# EAGLE design VCF-LM324-Stereo+LFO (EAGLE 7.6.0)
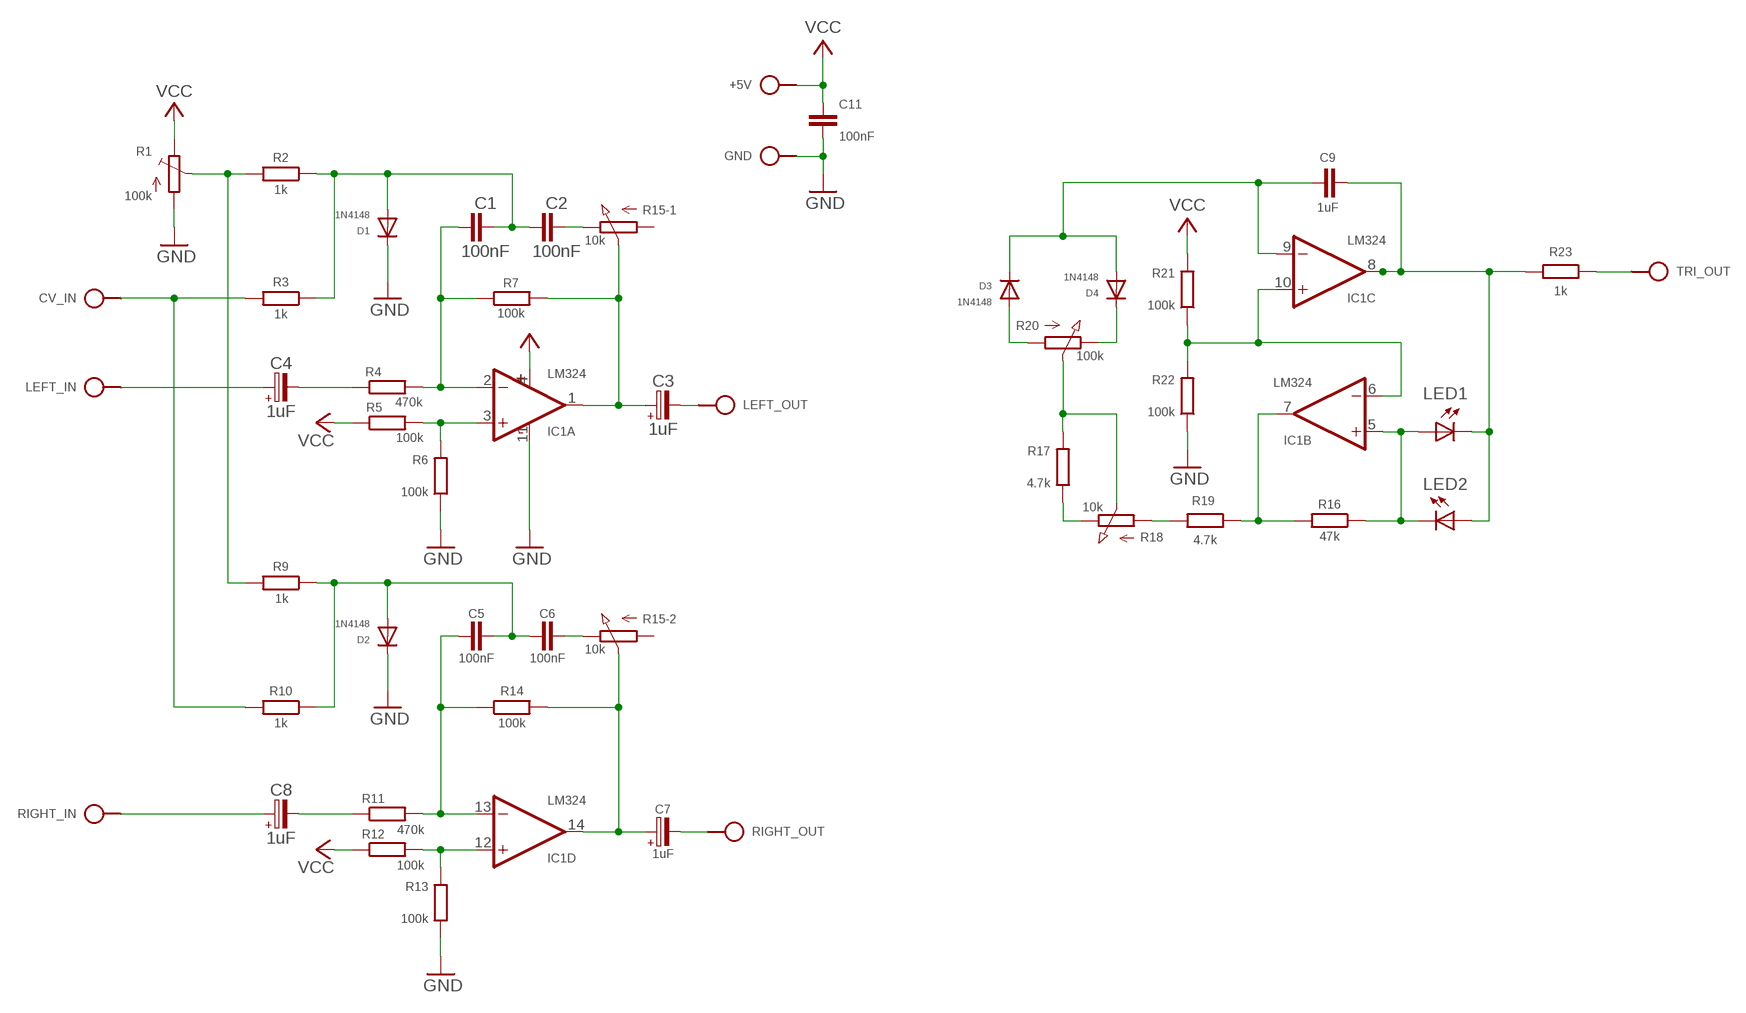
[diagram p0: schematic, sheet 1]

## Parts
+5V  VCC  SPAD  [SPAD]
C1  100nF  C050-024X044  [C050-024X044]
C2  100nF  C050-024X044  [C050-024X044]
C3  1uF  CPOLE2,5-3  [E2,5-3]
C4  1uF  CPOLE2,5-3  [E2,5-3]
C5  100nF  C050-024X044  [C050-024X044]
C6  100nF  C050-024X044  [C050-024X044]
C7  1uF  CPOLE2,5-3  [E2,5-3]
C8  1uF  CPOLE2,5-3  [E2,5-3]
C9  1uF  C050-024X044/V  [C050-024X044/V]
C11  100nF  C050-020X036  [C050-020X036]
CV_IN  CV_IN  SPAD  [SPAD]
D1  1N4148  1N414834-10V  [DO34-10V]
D2  1N4148  1N414834-7V  [DO34-7V]
D3  1N4148  1N414834-7V  [DO34-7V]
D4  1N4148  1N414834-7V  [DO34-7V]
GND  GND  SPAD  [SPAD]
IC1  LM324  LM324N  [DIL14]
LED1  LED3MM  [LED3MM]
LED2  LED3MM  [LED3MM]
LEFT_IN  AUDIO_IN  SPAD  [SPAD]
LEFT_OUT  AUDIO_OUT  SPAD  [SPAD]
R1  100k  TRIM  [B64Y]
R2  1k  R0202/7  [0202/7]
R3  1k  R0202/7  [0202/7]
R4  470k  R0202/7  [0202/7]
R5  100k  R0202/7  [0202/7]
R6  100k  R0202/7  [0202/7]
R7  100k  R0202/7  [0202/7]
R9  1k  R0202/7  [0202/7]
R10  1k  R0202/5  [0202/5]
R11  470k  R0202/7  [0202/7]
R12  100k  R0202/5  [0202/5]
R13  100k  R0202V  [0202V]
R14  100k  R0202/5  [0202/5]
R15  10k  POT-STEREO  [POT-STEREO]
R16  47k  R0202/7-V  [0202/7-V]
R17  4.7k  R0202/7  [0202/7]
R18  10k  POT  [POT]
R19  4.7k  R0202/7-V  [0202/7-V]
R20  100k  POT  [POT]
R21  100k  R0202/7-V  [0202/7-V]
R22  100k  R0202/7-V  [0202/7-V]
R23  1k  R0202/7-V  [0202/7-V]
RIGHT_IN  AUDIO_IN  SPAD  [SPAD]
RIGHT_OUT  AUDIO_OUT  SPAD  [SPAD]
TRI_OUT  TRIANGLE  SPAD  [SPAD]

## Nets
GND: C11.2 D1.C D2.C GND.1 IC1.11(P:V-) R1.A R6.1 R13.1 R22.1
N$1: C4.+ LEFT_IN.1
N$2: C1.1 IC1.2(A:-IN) R4.2 R7.1
N$3: C2.2 R15.1-3(-1:E)
N$4: C3.+ IC1.1(A:OUT) R7.2 R15.1-2(-1:S)
N$5: R1.S R2.2 R9.2
N$6: C3.- LEFT_OUT.1
N$7: IC1.3(A:+IN) R5.2 R6.2
N$8: CV_IN.1 R3.2 R10.2
N$9: C1.2 C2.1 D1.A R2.1 R3.1
N$10: C4.- R4.1
N$11: C6.2 R15.2-3(-2:E)
N$12: C7.+ IC1.14(D:OUT) R14.2 R15.2-2(-2:S)
N$13: IC1.12(D:+IN) R12.2 R13.2
N$14: IC1.7(B:OUT) R16.2 R19.1
N$15: IC1.5(B:+IN) LED1.A LED2.K(C) R16.1
N$16: C5.2 C6.1 D2.A R9.1 R10.1
N$17: C5.1 IC1.13(D:-IN) R11.2 R14.1
N$18: C7.- RIGHT_OUT.1
N$19: C8.+ RIGHT_IN.1
N$20: C8.- R11.1
N$26: C9.1 D3.C D4.A IC1.9(C:-IN)
N$28: C9.2 IC1.8(C:OUT) LED1.K(C) LED2.A R23.2
OA_C_IN+: IC1.6(B:-IN) IC1.10(C:+IN) R21.1 R22.2
TRI_OUT: R23.1 TRI_OUT.1
TRIM_1_A: D3.A R20.1(A)
TRIM_1_B: D4.C R20.3(E)
TRIM_2_A: R17.1 R18.3(E)
TRIM_2_B: R18.1(A) R19.2
TRIM_P: R17.2 R18.2(S) R20.2(S)
VCC: +5V.1 C11.1 IC1.4(P:V+) R1.E R5.1 R12.1 R21.2
Unconnected: R15.1-1(-1:A) R15.2-1(-2:A)

## Library data of the parts
+5V CV_IN GND LEFT_IN LEFT_OUT RIGHT_IN RIGHT_OUT TRI_OUT = pad:SPAD
C1 C2 C5 C6 C9 C11 = c:C: CAPACITOR, European symbol
C3 C4 C7 C8 = c:CPOL: POLARIZED CAPACITOR, European symbol
D1-D4 = d:1N4148
IC1 = ic:LM324: OP AMP
LED1 LED2 = led:LED: LED OSRAM: - CHIPLED LG R971, LG N971, LY N971, LG Q971, LY Q971, LO R971, LY R971 LH N974, LH R974 LS Q976, LO Q976, LY Q976 LO Q996 - Hyper CHIPLED LW Q18S LB Q993, LB Q99A, LB R99A - SideLED LS A670, LO A670, LY A670, LG A670, LP A670 LB A673, LV A673, LT A673, LW A673 LH A674 LY A675 LS A676, LA A676, LO A676, LY A676, LW A676 LS A679, LY A679, LG A679 - Hyper Micro SIDELED® LS Y876, LA Y876, LO Y876, LY Y876 LT Y87S - SmartLED LW L88C, LW L88S LB L89C, LB L89S, LG L890 LS L89K, LO L89K, LY L89K LS L896, LA L896, LO L896, LY L896 - TOPLED LS T670, LO T670, LY T670, LG T670, LP T670 LSG T670, LSP T670, LSY T670, LOP T670, LYG T670 LG T671, LOG T671, LSG T671 LB T673, LV T673, LT T673, LW T673 LH T674 LS T676, LA T676, LO T676, LY T676, LB T676, LH T676, LSB T676, LW T676 LB T67C, LV T67C, LT T67C, LS T67K, LO T67K, LY T67K, LW E67C LS E67B, LA E67B, LO E67B, LY E67B, LB E67C, LV E67C, LT E67C LW T67C LS T679, LY T679, LG T679 LS T770, LO T770, LY T770, LG T770, LP T770 LB T773, LV T773, LT T773, LW T773 LH T774 LS E675, LA E675, LY E675, LS T675 LS T776, LA T776, LO T776, LY T776, LB T776 LHGB T686 LT T68C, LB T68C - Hyper Mini TOPLED® LB M676 - Mini TOPLED Santana® LG M470 LS M47K, LO M47K, LY M47K Source: http://www.osram.convergy.de LUXEON: - LUMILED® LXK2-PW12-R00, LXK2-PW12-S00, LXK2-PW14-U00, LXK2-PW14-V00 LXK2-PM12-R00, LXK2-PM12-S00, LXK2-PM14-U00 LXK2-PE12-Q00, LXK2-PE12-R00, LXK2-PE12-S00, LXK2-PE14-T00, LXK2-PE14-U00 LXK2-PB12-K00, LXK2-PB12-L00, LXK2-PB12-M00, LXK2-PB14-N00, LXK2-PB14-P00, LXK2-PB14-Q00 LXK2-PR12-L00, LXK2-PR12-M00, LXK2-PR14-Q00, LXK2-PR14-R00 LXK2-PD12-Q00, LXK2-PD12-R00, LXK2-PD12-S00 LXK2-PH12-R00, LXK2-PH12-S00 LXK2-PL12-P00, LXK2-PL12-Q00, LXK2-PL12-R00 Source: www.luxeon.com KINGBRIGHT: KA-3528ASYC Source: www.kingbright.com
R1 = r:TRIM: POTENTIOMETER
R2-R7 R9-R14 R16 R17 R19 R21-R23 = r:R: RESISTOR, European symbol
R15 = r:POT-STEREO
R18 R20 = r:POT

## Module LFO
Ports: TRI_OUT(io) GND(io) VCC(io)
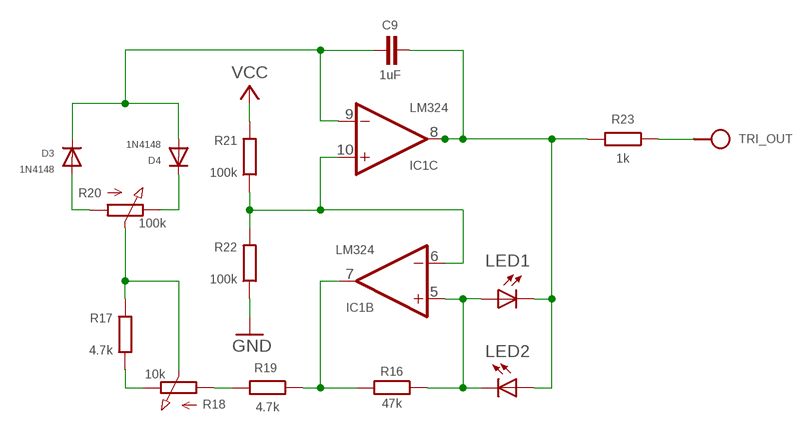
[diagram p1: schematic, module LFO, sheet 1]

### Parts
C9  1uF  C050-024X044/V  [C050-024X044/V]
D3  1N4148  1N414834-7V  [DO34-7V]
D4  1N4148  1N414834-7V  [DO34-7V]
IC1  LM324  LM324N  [DIL14]
LED1  LED3MM  [LED3MM]
LED2  LED3MM  [LED3MM]
R16  47k  R0202/7-V  [0202/7-V]
R17  4.7k  R0202/7  [0202/7]
R18  10k  POT  [POT]
R19  4.7k  R0202/7-V  [0202/7-V]
R20  100k  POT  [POT]
R21  100k  R0202/7-V  [0202/7-V]
R22  100k  R0202/7-V  [0202/7-V]
R23  1k  R0202/7-V  [0202/7-V]
TRI_OUT  TRIANGLE  SPAD  [SPAD]

### Nets
GND: R22.1
N$14: IC1.7(B:OUT) R16.2 R19.1
N$15: IC1.5(B:+IN) LED1.A LED2.K(C) R16.1
N$26: C9.1 D3.C D4.A IC1.9(C:-IN)
N$28: C9.2 IC1.8(C:OUT) LED1.K(C) LED2.A R23.2
OA_C_IN+: IC1.6(B:-IN) IC1.10(C:+IN) R21.1 R22.2
TRI_OUT: R23.1 TRI_OUT.1
TRIM_1_A: D3.A R20.1(A)
TRIM_1_B: D4.C R20.3(E)
TRIM_2_A: R17.1 R18.3(E)
TRIM_2_B: R18.1(A) R19.2
TRIM_P: R17.2 R18.2(S) R20.2(S)
VCC: R21.2
Unconnected: IC1.1(A:OUT) IC1.2(A:-IN) IC1.3(A:+IN) IC1.12(D:+IN) IC1.13(D:-IN) IC1.14(D:OUT)

### Power pins joined to a net without a drawn wire
V+: IC1.4(P:V+)
V-: IC1.11(P:V-)

### Library data of the parts
C9 = c:C: CAPACITOR, European symbol
D3 D4 = d:1N4148
IC1 = ic:LM324: OP AMP
LED1 LED2 = led:LED: LED OSRAM: - CHIPLED LG R971, LG N971, LY N971, LG Q971, LY Q971, LO R971, LY R971 LH N974, LH R974 LS Q976, LO Q976, LY Q976 LO Q996 - Hyper CHIPLED LW Q18S LB Q993, LB Q99A, LB R99A - SideLED LS A670, LO A670, LY A670, LG A670, LP A670 LB A673, LV A673, LT A673, LW A673 LH A674 LY A675 LS A676, LA A676, LO A676, LY A676, LW A676 LS A679, LY A679, LG A679 - Hyper Micro SIDELED® LS Y876, LA Y876, LO Y876, LY Y876 LT Y87S - SmartLED LW L88C, LW L88S LB L89C, LB L89S, LG L890 LS L89K, LO L89K, LY L89K LS L896, LA L896, LO L896, LY L896 - TOPLED LS T670, LO T670, LY T670, LG T670, LP T670 LSG T670, LSP T670, LSY T670, LOP T670, LYG T670 LG T671, LOG T671, LSG T671 LB T673, LV T673, LT T673, LW T673 LH T674 LS T676, LA T676, LO T676, LY T676, LB T676, LH T676, LSB T676, LW T676 LB T67C, LV T67C, LT T67C, LS T67K, LO T67K, LY T67K, LW E67C LS E67B, LA E67B, LO E67B, LY E67B, LB E67C, LV E67C, LT E67C LW T67C LS T679, LY T679, LG T679 LS T770, LO T770, LY T770, LG T770, LP T770 LB T773, LV T773, LT T773, LW T773 LH T774 LS E675, LA E675, LY E675, LS T675 LS T776, LA T776, LO T776, LY T776, LB T776 LHGB T686 LT T68C, LB T68C - Hyper Mini TOPLED® LB M676 - Mini TOPLED Santana® LG M470 LS M47K, LO M47K, LY M47K Source: http://www.osram.convergy.de LUXEON: - LUMILED® LXK2-PW12-R00, LXK2-PW12-S00, LXK2-PW14-U00, LXK2-PW14-V00 LXK2-PM12-R00, LXK2-PM12-S00, LXK2-PM14-U00 LXK2-PE12-Q00, LXK2-PE12-R00, LXK2-PE12-S00, LXK2-PE14-T00, LXK2-PE14-U00 LXK2-PB12-K00, LXK2-PB12-L00, LXK2-PB12-M00, LXK2-PB14-N00, LXK2-PB14-P00, LXK2-PB14-Q00 LXK2-PR12-L00, LXK2-PR12-M00, LXK2-PR14-Q00, LXK2-PR14-R00 LXK2-PD12-Q00, LXK2-PD12-R00, LXK2-PD12-S00 LXK2-PH12-R00, LXK2-PH12-S00 LXK2-PL12-P00, LXK2-PL12-Q00, LXK2-PL12-R00 Source: www.luxeon.com KINGBRIGHT: KA-3528ASYC Source: www.kingbright.com
R16 R17 R19 R21-R23 = r:R: RESISTOR, European symbol
R18 R20 = r:POT
TRI_OUT = pad:SPAD

## Module VCF-L
Ports: 

### Library data of the parts

## Board
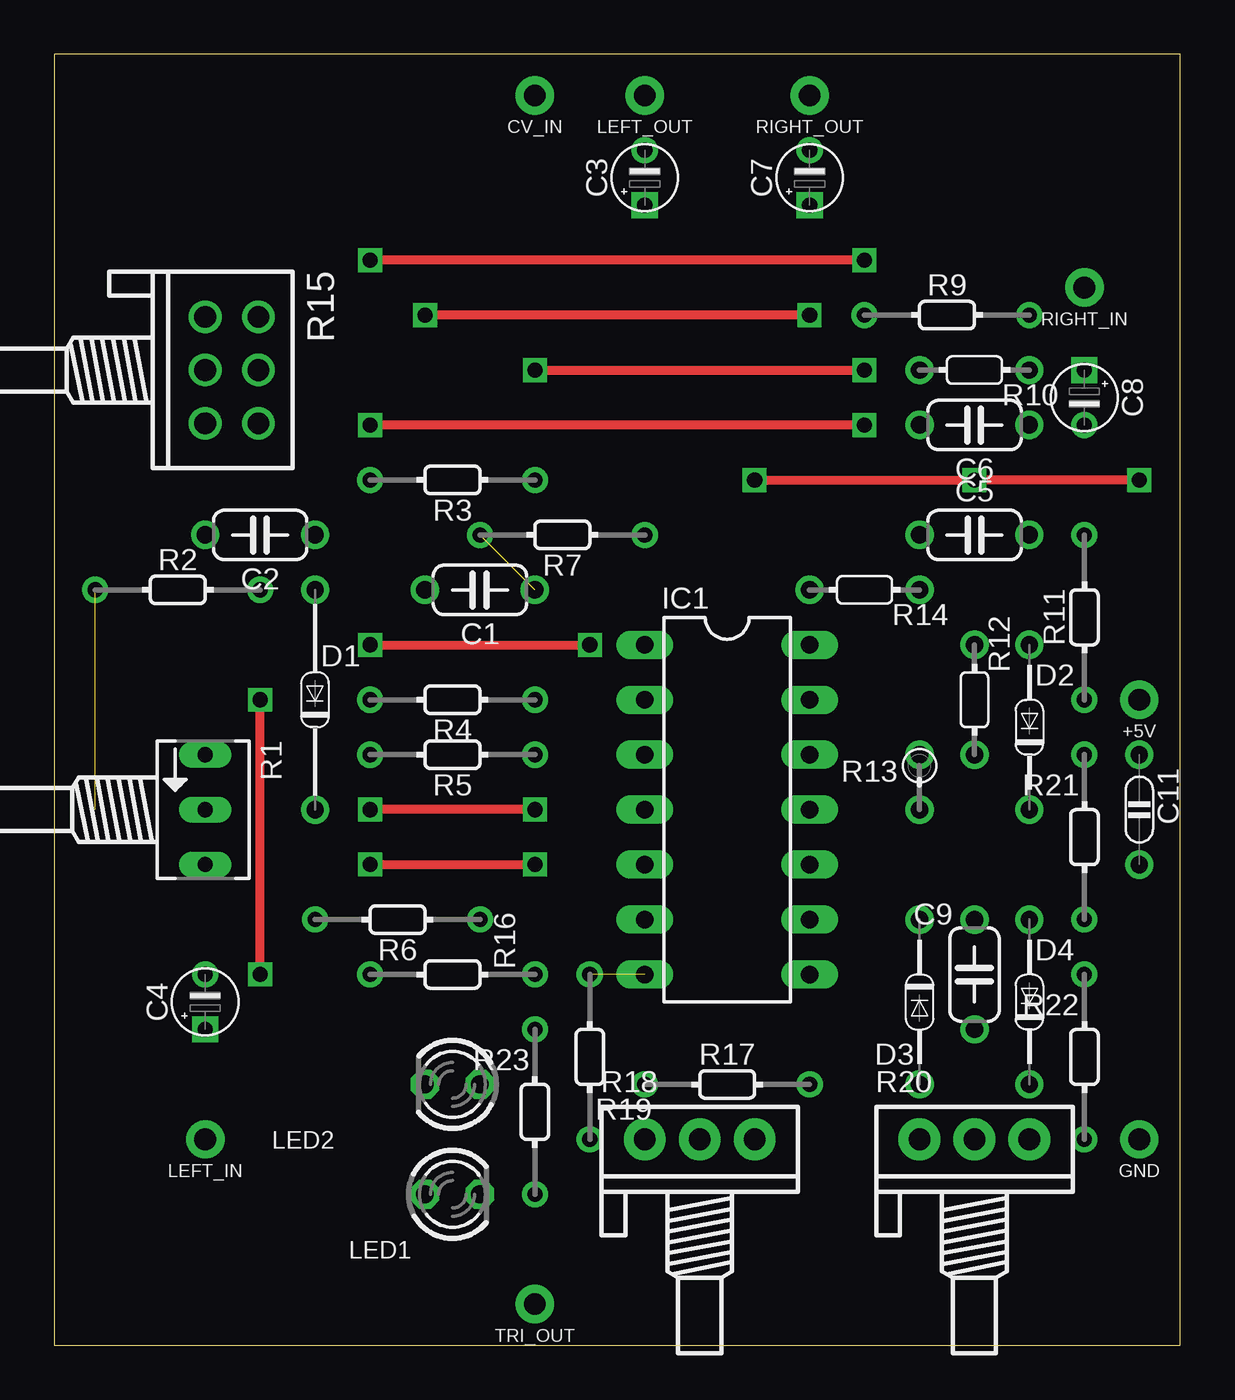
[diagram p2: board, top side]
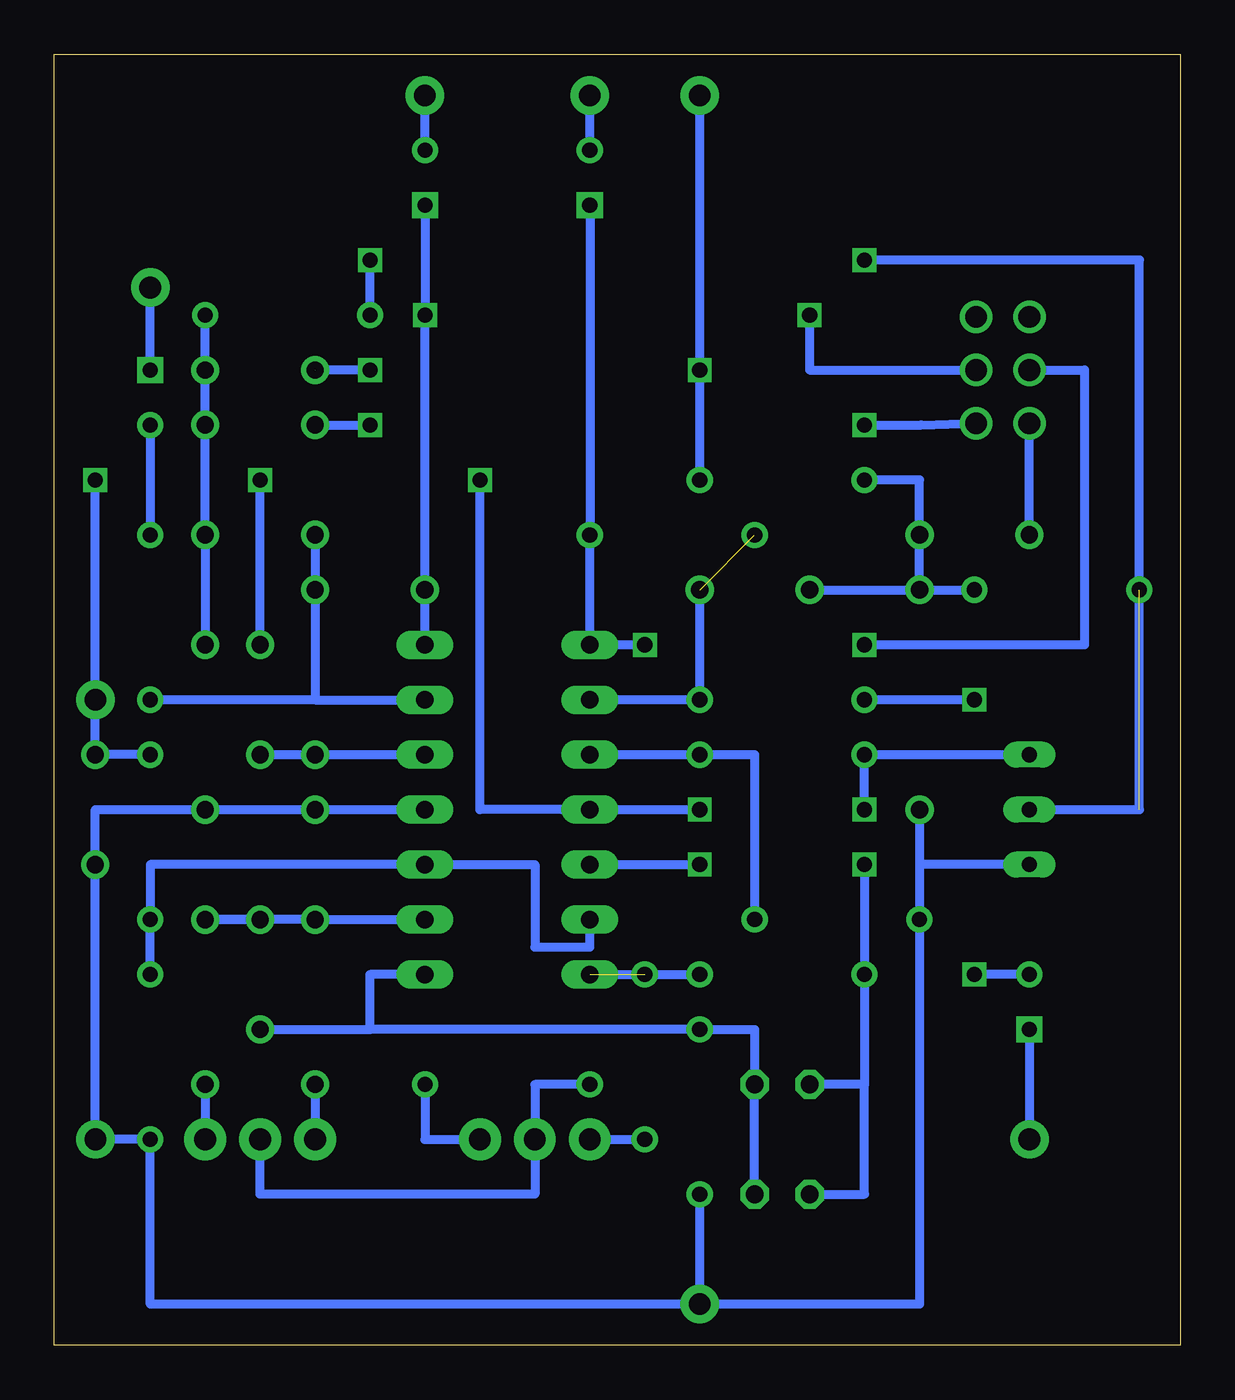
[diagram p3: board, bottom side, seen from below]

Size 52.07 x 59.69 mm. Coordinates in mm from the lower left corner, seen from the top.
Outline: 0,0 52.07,0 52.07,59.69 0,59.69 0,0
Copper layers (1*16): Top 0.035mm / dielectric 1.5mm / Bottom 0.035mm
Design rules "default *": minimum track width 10mil, minimum drill 24mil, track to track 8mil, track to pad 8mil, pad to pad 8mil, via to via 8mil, smd to smd 8mil, copper to edge 40mil, drill to drill 8mil, minimum pad ring 10mil, minimum via ring 8mil, stop-mask expansion 0mil, vias tented up to drill 0mil, thermal gap 10mil

### Footprints (pad centres in the part's own frame; a part is rotated, then mirrored left to right if it is on the bottom)
SPAD = drill 1 pad 1.778: 1 0,0
C050-024X044 = drill 0.8: 1 -2.54,0; 2 2.54,0
E2,5-3 = drill 0.7 square: + 0,1.27 | drill 0.7: - 0,-1.27
C050-024X044/V = drill 0.8: 1 0,2.54; 2 0,-2.54
C050-020X036 = drill 0.8: 1 -2.54,0; 2 2.54,0
DO34-10V = drill 0.8: A 0,5.08; C 0,-5.08
DO34-7V = drill 0.8: A 0,3.81; C 0,-3.81
DIL14 = drill 0.8 long: 1 -3.81,7.62; 2 -3.81,5.08; 3 -3.81,2.54; 4 -3.81,0; 5 -3.81,-2.54; 6 -3.81,-5.08; 7 -3.81,-7.62; 8 3.81,-7.62; 9 3.81,-5.08; 10 3.81,-2.54; 11 3.81,0; 12 3.81,2.54; 13 3.81,5.08; 14 3.81,7.62
LED3MM = drill 0.813 octagon: A -1.27,0; K 1.27,0
B64Y = drill 0.7 long: A 2.54,0; E -2.54,0; S 0,0
0202/7 = drill 0.7: 1 0,3.81; 2 0,-3.81
0202/5 = drill 0.8: 1 -2.54,0; 2 2.54,0
0202V = drill 0.8: 1 0,-1.27; 2 0,1.27
POT-STEREO = drill 1: 1-1 -2.46,-2.54; 1-2 0,-2.54; 1-3 2.46,-2.54; 2-1 -2.46,-0.08; 2-2 0,-0.08; 2-3 2.46,-0.08
0202/7-V = drill 0.7: 1 0,-3.81; 2 0,3.81
POT = drill 1 pad 1.93: 1 -2.54,0; 2 0,0; 3 2.54,0

### Placement (x,y rotation side)
+5V  50.17,29.84 90 top
C1  19.69,34.93 180 top
C2  9.53,37.47 180 top
C3  27.3,53.98 180 top
C4  6.98,15.88 180 top
C5  42.55,37.47 0 top
C6  42.55,42.55 180 top
C7  34.92,53.98 180 top
C8  47.62,43.82 0 top
C9  42.55,17.15 0 top
C11  50.17,24.77 270 top
CV_IN  22.23,57.79 90 top
D1  12.06,29.84 0 top
D2  45.08,28.58 0 top
D3  40,15.88 180 top
D4  45.08,15.88 0 top
GND  50.17,9.53 90 top
IC1  31.11,24.77 0 top
LED1  18.41,6.99 0 top
LED2  18.41,12.07 180 top
LEFT_IN  6.98,9.53 90 top
LEFT_OUT  27.3,57.79 90 top
R1  6.98,24.77 270 top
R2  5.71,34.93 270 top
R3  18.41,40.01 90 top
R4  18.41,29.84 90 top
R5  18.41,27.3 90 top
R6  15.88,19.69 90 top
R7  23.5,37.47 90 top
R9  41.28,47.62 270 top
R10  42.55,45.09 180 top
R11  47.62,33.66 0 top
R12  42.55,29.84 270 top
R13  40,26.04 0 top
R14  37.47,34.93 180 top
R15  9.53,45.09 270 top
R16  18.41,17.15 270 top
R17  31.11,12.07 270 top
R18  29.84,9.53 0 top
R19  24.77,13.34 180 top
R20  42.55,9.53 0 top
R21  47.62,23.5 0 top
R22  47.62,13.34 0 top
R23  22.23,10.8 0 top
RIGHT_IN  47.62,48.9 90 top
RIGHT_OUT  34.92,57.79 90 top
TRI_OUT  22.23,1.91 90 top

### Tracks (layer width: path | path; a pad name or v marks a point on that pad's centre or on a via)
GND
  Bottom 0.406: IC1.11 R13.1 D2.C 50.17,24.77 C11.2 GND.1 R22.1 47.62,1.91 12.06,1.91 R6.1 | D1.C R6.1 | R1.A 12.06,22.23 R6.1
N$1
  Bottom 0.406: C4.+ LEFT_IN.1
N$2  (1 unrouted)
  Bottom 0.406: IC1.2 R4.2 C1.1
N$3
  Bottom 0.406: C2.2 R15.1-3
N$4  (via drill 0.7)
  Top 0.406: v14.61,32.38 v24.77,32.38
  Bottom 0.406: C3.+ R7.2 IC1.1 v24.77,32.38 | R15.1-2 4.45,45.09 4.45,32.38 v14.61,32.38
N$5  (via drill 0.7)  (1 unrouted)
  Top 0.406: v37.47,50.16 v14.61,50.16
  Bottom 0.406: R1.S 1.9,24.77 1.9,50.16 v14.61,50.16 | R9.2 v37.47,50.16
N$6
  Bottom 0.406: C3.- LEFT_OUT.1
N$7
  Bottom 0.406: IC1.3 R5.2 19.69,27.3 R6.2
N$8  (via drill 0.7)  (1 unrouted)
  Top 0.406: v22.23,45.09 v37.47,45.09
  Bottom 0.406: v22.23,45.09 R3.2 CV_IN.1 | v37.47,45.09 R10.2
N$9
  Bottom 0.406: C1.2 D1.A | D1.A C2.1 12.06,40.01 R3.1 | D1.A R2.1
N$10  (via drill 0.7)
  Top 0.406: v9.53,17.15 v9.53,29.84
  Bottom 0.406: C4.- v9.53,17.15 | v9.53,29.84 R4.1
N$11  (via drill 0.7)
  Top 0.406: v37.47,42.55 v14.61,42.55
  Bottom 0.406: C6.2 v37.47,42.55 | v14.61,42.55 11.98,42.55 R15.2-3
N$12  (via drill 0.7)
  Top 0.406: v34.92,47.62 v17.14,47.62
  Bottom 0.406: IC1.14 R14.2 v34.92,47.62 C7.+ | v17.14,47.62 17.14,45.09 R15.2-2
N$13
  Bottom 0.406: R12.2 R13.2 IC1.12
N$14  (1 unrouted)
  Bottom 0.406: IC1.7 R16.2
N$15  (via drill 0.7)
  Top 0.406: v14.61,22.23 v22.23,22.23
  Bottom 0.406: v14.61,22.23 R16.1 14.61,12.07 | LED1.A 14.61,6.99 14.61,12.07 | 14.61,12.07 LED2.K | IC1.5 v22.23,22.23
N$16
  Bottom 0.406: D2.A C5.2 C6.1 R10.1 R9.1
N$17
  Bottom 0.406: C5.1 R14.1 40,29.84 | 40,29.84 IC1.13 | 40,29.84 R11.2
N$18
  Bottom 0.406: C7.- RIGHT_OUT.1
N$19
  Bottom 0.406: C8.+ RIGHT_IN.1
N$20
  Bottom 0.406: C8.- R11.1
N$26
  Bottom 0.406: C9.1 D4.A D3.C IC1.9
N$28
  Bottom 0.406: 37.47,14.61 R23.2 19.69,14.61 LED2.A LED1.K | C9.2 37.47,14.61 | 37.47,14.61 37.47,17.15 IC1.8
OA_C_IN+
  Bottom 0.406: R22.2 R21.1 47.62,22.23 IC1.10 29.84,22.23 29.84,18.41 27.3,18.41 IC1.6
TRI_OUT
  Bottom 0.406: TRI_OUT.1 R23.1
TRIM_1_A
  Bottom 0.406: D3.A R20.1
TRIM_1_B
  Bottom 0.406: D4.C R20.3
TRIM_2_A
  Bottom 0.406: R17.1 34.92,9.53 R18.3
TRIM_2_B
  Bottom 0.406: R18.1 R19.2
TRIM_P
  Bottom 0.406: R17.2 29.84,12.07 R18.2 29.84,6.99 42.55,6.99 R20.2
VCC  (via drill 0.7)
  Top 0.406: v22.23,24.77 v14.61,24.77 | v50.17,40.01 v42.55,40.01 v32.39,40.01
  Bottom 0.406: 28.57,24.77 IC1.4 | IC1.4 v22.23,24.77 | v14.61,24.77 R5.1 R1.E | R21.2 C11.1 +5V.1 v50.17,40.01 | R12.1 v42.55,40.01 | IC1.4 32.39,24.77 v32.39,40.01